# EAGLE design PitchDetector (EAGLE 9.5.1)
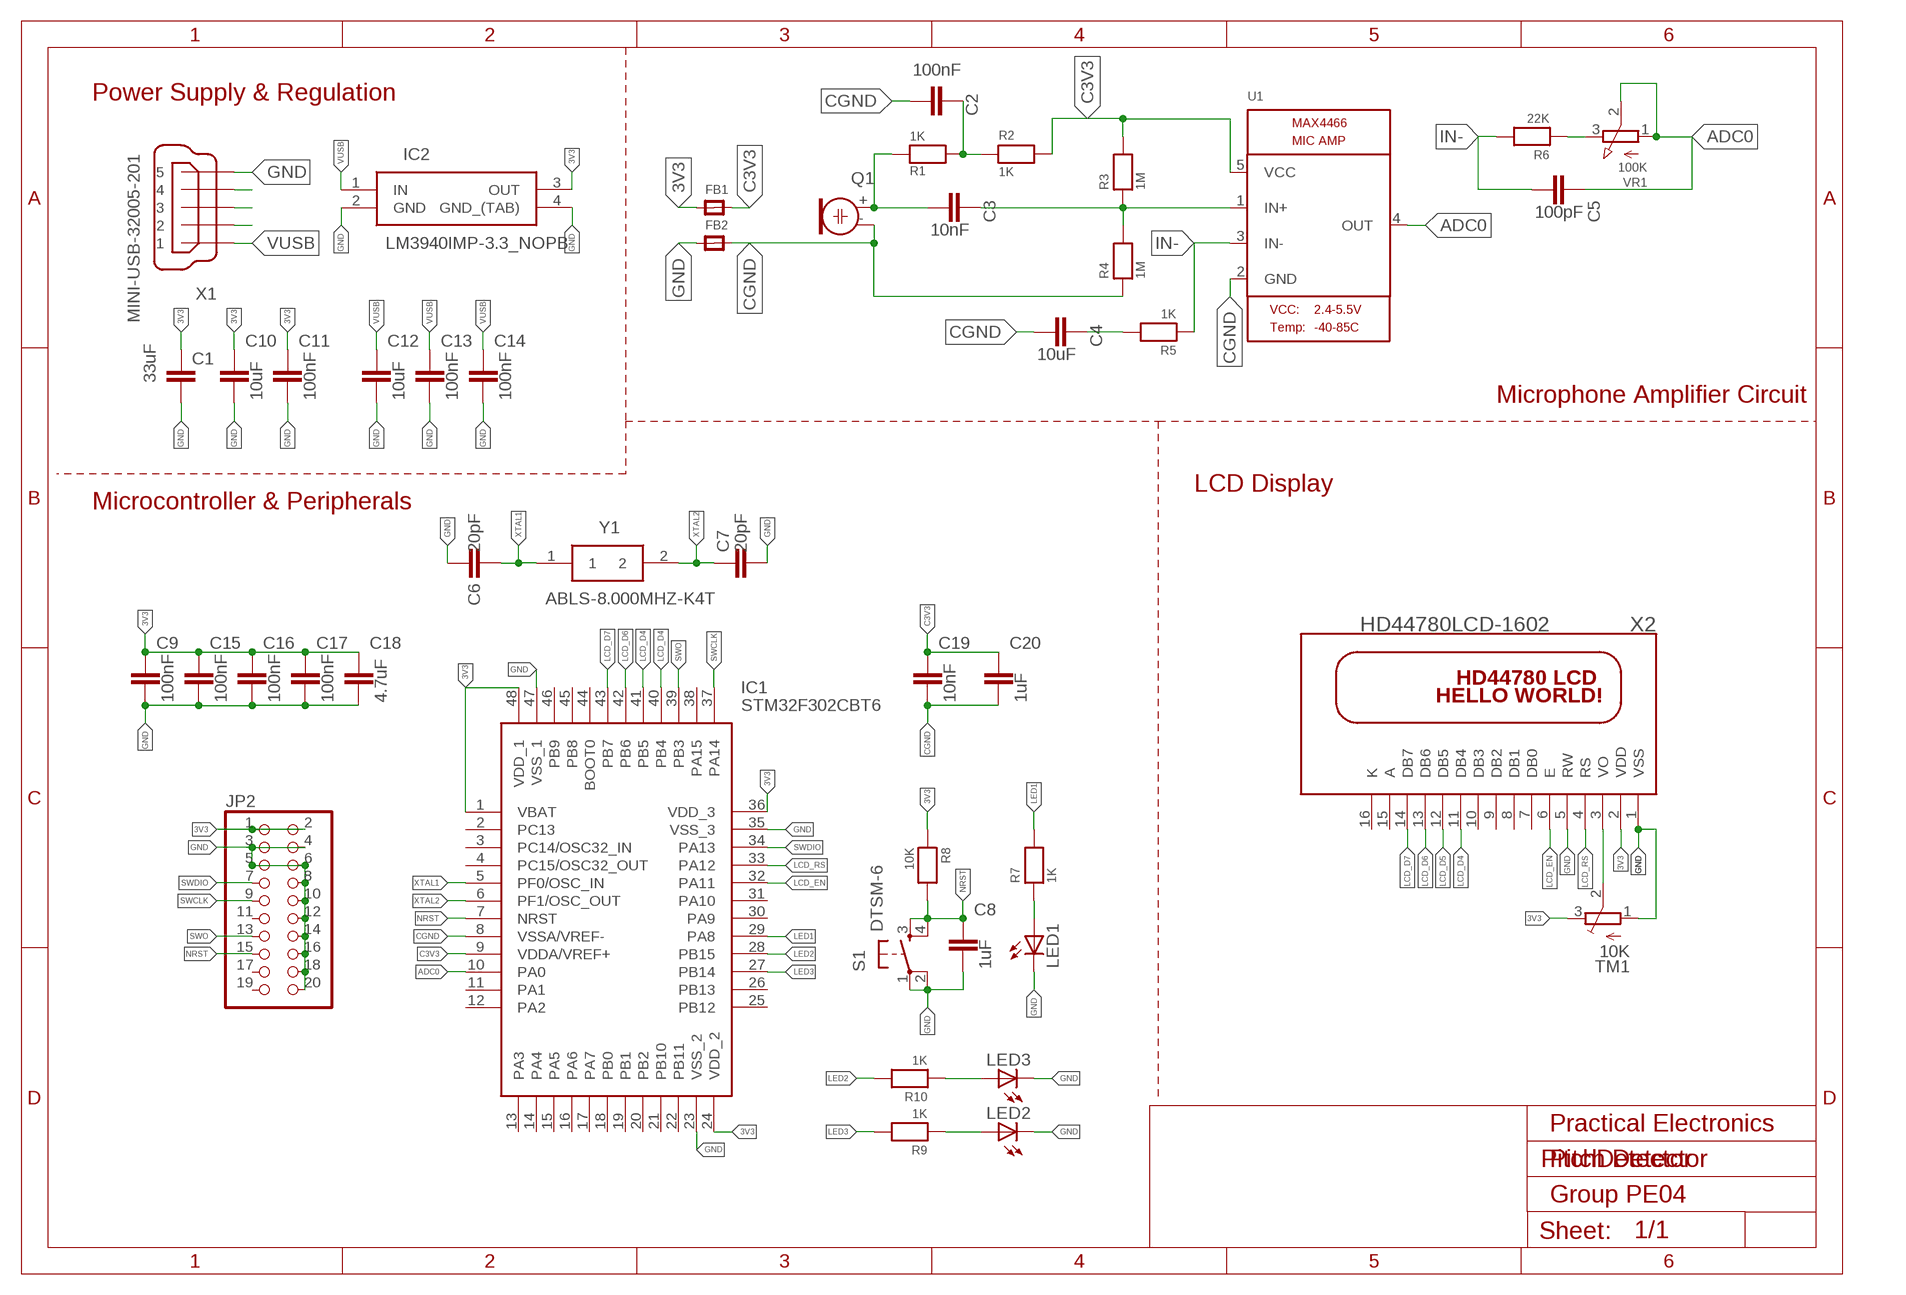
[diagram p0: schematic, sheet 1]

## Parts
C1  33uF  C-EUC1206K  [C1206K]
C2  100nF  C-EUC1206K  [C1206K]
C3  10nF  C-EUC1206K  [C1206K]
C4  10uF  C-EUC1206K  [C1206K]
C5  100pF  C-EUC1206K  [C1206K]
C6  20pF  C-EUC0805K  [C0805K]
C7  20pF  C-EUC0805K  [C0805K]
C8  1uF  C-EUC1206K  [C1206K]
C9  100nF  C-EUC1206K  [C1206K]
C10  10uF  C-EUC1206K  [C1206K]
C11  100nF  C-EUC1206K  [C1206K]
C12  10uF  C-EUC1206K  [C1206K]
C13  100nF  C-EUC1206K  [C1206K]
C14  100nF  C-EUC1206K  [C1206K]
C15  100nF  C-EUC1206K  [C1206K]
C16  100nF  C-EUC1206K  [C1206K]
C17  100nF  C-EUC1206K  [C1206K]
C18  4.7uF  C-EUC1206K  [C1206K]
C19  10nF  C-EUC1206K  [C1206K]
C20  1uF  C-EUC1206K  [C1206K]
FB1  MICROBUILDER_FERRITE_0805  [MICROBUILDER__0805]
FB2  MICROBUILDER_FERRITE_0805  [MICROBUILDER__0805]
IC1  STM32F302CBT6  [QFP50P900X900X160-48N]
IC2  LM3940IMP-3.3_NOPB  [SOT230P700X180-4N]
JP2  PINHD-2X10  [2X10]
LED1  LEDCHIPLED_1206  [CHIPLED_1206]
LED2  LEDCHIPLED_1206  [CHIPLED_1206]
LED3  LEDCHIPLED_1206  [CHIPLED_1206]
Q1  MICROBUILDER_ELECTRET  [MICROBUILDER_ELECTRET_9.7]
R1  1K  MICROBUILDER_RESISTOR1206  [MICROBUILDER_1206]
R2  1K  MICROBUILDER_RESISTOR1206  [MICROBUILDER_1206]
R3  1M  MICROBUILDER_RESISTOR1206  [MICROBUILDER_1206]
R4  1M  MICROBUILDER_RESISTOR1206  [MICROBUILDER_1206]
R5  1K  MICROBUILDER_RESISTOR1206  [MICROBUILDER_1206]
R6  22K  MICROBUILDER_RESISTOR1206  [MICROBUILDER_1206]
R7  1K  MICROBUILDER_RESISTOR1206  [MICROBUILDER_1206]
R8  10K  MICROBUILDER_RESISTOR1206  [MICROBUILDER_1206]
R9  1K  MICROBUILDER_RESISTOR1206  [MICROBUILDER_1206]
R10  1K  MICROBUILDER_RESISTOR1206  [MICROBUILDER_1206]
S1  DTSM-6  [DTSM-6]
TM1  10K  TRIMPOTTC33X  [TC33X]
U1  MICROBUILDER_MAX4466""  [MICROBUILDER_SC70-5]
VR1  100K  MICROBUILDER_TRIMPOTTC33X-2  [MICROBUILDER_TRIMPOT_BOURNS_TC33X-2]
X1  MINI-USB-32005-201  [32005-201]
X2  HD44780LCD-1602  [LCD1602]
Y1  ABLS-8.000MHZ-K4T  [ABLS-12.000MHZ-B2]

## Nets
3V3: C1.1 C9.1 C10.1 C11.1 C15.1 C16.1 C17.1 C18.1 FB1.1 IC1.1(VBAT) IC1.24(VDD_2) IC1.36(VDD_3) IC1.48(VDD_1) IC2.3(OUT) JP2.1 JP2.2 R8.1 TM1.3(E) X2.2(VDD)
ADC0: C5.1 IC1.10(PA0) U1.4(OUT) VR1.1(A) VR1.2(S)
C3V3: C19.1 C20.1 FB1.2 IC1.9(VDDA/VREF+) R2.2 R3.2 U1.5(VCC)
CGND: C2.2 C4.2 C19.2 C20.2 FB2.2 IC1.8(VSSA/VREF-) Q1.- R4.1 U1.2(GND)
GND: C1.2 C6.1 C7.2 C8.2 C9.2 C10.2 C11.2 C12.2 C13.2 C14.2 C15.2 C16.2 C17.2 C18.2 FB2.1 IC1.23(VSS_2) IC1.35(VSS_3) IC1.47(VSS_1) IC2.2(GND) IC2.4(GND_(TAB)) JP2.3 JP2.4 JP2.5 JP2.6 JP2.8 JP2.10 JP2.12 JP2.14 JP2.16 JP2.18 JP2.20 LED1.C LED2.C LED3.C S1.1 S1.2 TM1.1(A) X1.5 X2.1(VSS) X2.5(RW)
IN-: C5.2 R5.1 R6.2 U1.3(IN-)
LCD_D4: IC1.40(PB4) IC1.41(PB5) X2.11(DB4)
LCD_D5: X2.12(DB5)
LCD_D6: IC1.42(PB6) X2.13(DB6)
LCD_D7: IC1.43(PB7) X2.14(DB7)
LCD_EN: IC1.32(PA11) X2.6(E)
LCD_RS: IC1.33(PA12) X2.4(RS)
LED1: IC1.29(PA8) R7.2
LED2: IC1.28(PB15) R10.2
LED3: IC1.27(PB14) R9.2
N$1: LED1.A R7.1
N$2: X1.4
N$3: X1.3
N$4: X1.2
N$5: C3.2 Q1.+ R1.1
N$6: C2.1 R1.2 R2.1
N$7: C3.1 R3.1 R4.2 U1.1(IN+)
N$8: R6.1 VR1.3(E)
N$9: C4.1 R5.2
N$10: TM1.2(S) X2.3(VO)
N$11: LED3.A R10.1
N$12: LED2.A R9.1
NRST: C8.1 IC1.7(NRST) JP2.15 R8.2 S1.3 S1.4
SWCLK: IC1.37(PA14) JP2.9
SWDIO: IC1.34(PA13) JP2.7
SWO: IC1.39(PB3) JP2.13
VUSB: C12.1 C13.1 C14.1 IC2.1(IN) X1.1
XTAL1: C6.2 IC1.5(PF0/OSC_IN) Y1.1
XTAL2: C7.1 IC1.6(PF1/OSC_OUT) Y1.2
Unconnected: IC1.2(PC13) IC1.3(PC14/OSC32_IN) IC1.4(PC15/OSC32_OUT) IC1.11(PA1) IC1.12(PA2) IC1.13(PA3) IC1.14(PA4) IC1.15(PA5) IC1.16(PA6) IC1.17(PA7) IC1.18(PB0) IC1.19(PB1) IC1.20(PB2) IC1.21(PB10) IC1.22(PB11) IC1.25(PB12) IC1.26(PB13) IC1.30(PA9) IC1.31(PA10) IC1.38(PA15) IC1.44(BOOT0) IC1.45(PB8) IC1.46(PB9) JP2.11 JP2.17 JP2.19 X2.7(DB0) X2.8(DB1) X2.9(DB2) X2.10(DB3) X2.15(A) X2.16(K)

## Notes on the sheet
- Power Supply & Regulation
- Microphone Amplifier Circuit
- LCD Display
- Microcontroller & Peripherals
- Practical Electronics
- Pitch Detector
- Group PE04

## Library data of the parts
C1-C5 C8-C20 = resistor:C-EU: CAPACITOR, European symbol
C6 C7 = rcl:C-EU: CAPACITOR, European symbol; SPICEPREFIX: C
FB1 FB2 = Adafruit MAX4466 Mic Amp:MICROBUILDER_FERRITE: Ferrite Bead 0603 MMZ1608B121C - 120 Ohm @ 100MHz, 600mA, 0.15 Ohm DC Resistance - Digikey: 445-2164-1-ND BK1608HW121-T - 120 Ohm, 600mA Ferrite Chip - Digikey: 587-1876-2-ND 0805 HZ0805B272R-10 - 2.7K Ohm @ 100MHz, 200mA, 0.8 Ohm DC Resistance - Digikey: 240-2504-1-ND (see also Murata BLM21BD272SN1L) MMZ2012Y152B - 1.5K Ohm @ 100MHz, 500mA, 0.4 Ohm DC Resistance - Digikey: 445-1560-1-ND - Mainly for high frequency (80-400MHz) MMZ2012R102A - 1K Ohm @ 100MHz, 500mA, 0.3 Ohm DC Resistance - Digikey: 445-1555-2-ND - More general purpose (10-200MHz)
IC1 = SamacSys_Parts:STM32F302CBT6: Source: Datasheet <http://www.st.com/web/en/resource/technical/document/datasheet/DM00094064.pdf>; ALLIED_NUMBER: 70520770; ALLIED_PRICE-STOCK: http://www.alliedelec.com/stmicroelectronics-stm32f302cbt6/70520770/; HEIGHT: 1.6mm; MANUFACTURER_NAME: STMicroelectronics; MANUFACTURER_PART_NUMBER: STM32F302CBT6; MOUSER_PART_NUMBER: 511-STM32F302CBT6; MOUSER_PRICE-STOCK: https://www.mouser.com/Search/Refine.aspx?Keyword=511-STM32F302CBT6; RS_PART_NUMBER: 8107641P; RS_PRICE-STOCK: http://uk.rs-online.com/web/p/products/8107641P
IC2 = SamacSys_Parts:LM3940IMP-3.3_NOPB: LM3940IMP-3.3/NOPB, Low Dropout Voltage Regulator, 1A, 3.3 V, 4.5 7.5 Vin, 4-Pin SOT-223 Source: Datasheet <http://www.ti.com/lit/ds/symlink/lm3940.pdf>; DESCRIPTION: LM3940IMP-3.3/NOPB, Low Dropout Voltage Regulator, 1A, 3.3 V, 4.5 7.5 Vin, 4-Pin SOT-223; HEIGHT: 1.8mm; MANUFACTURER_NAME: Texas Instruments; MANUFACTURER_PART_NUMBER: LM3940IMP-3.3/NOPB; MOUSER_PART_NUMBER: 926-LM3940IMP3.3NOPB; MOUSER_PRICE-STOCK: https://www.mouser.com/Search/Refine.aspx?Keyword=926-LM3940IMP3.3NOPB
JP2 = pinhead:PINHD-2X10: PIN HEADER
LED1-LED3 = adafruit:LED: LED OSRAM: - CHIPLED LG R971, LG N971, LY N971, LG Q971, LY Q971, LO R971, LY R971 LH N974, LH R974 LS Q976, LO Q976, LY Q976 LO Q996 - Hyper CHIPLED LW Q18S LB Q993, LB Q99A, LB R99A - SideLED LS A670, LO A670, LY A670, LG A670, LP A670 LB A673, LV A673, LT A673, LW A673 LH A674 LY A675 LS A676, LA A676, LO A676, LY A676, LW A676 LS A679, LY A679, LG A679 - Hyper Micro SIDELED® LS Y876, LA Y876, LO Y876, LY Y876 LT Y87S - SmartLED LW L88C, LW L88S LB L89C, LB L89S, LG L890 LS L89K, LO L89K, LY L89K LS L896, LA L896, LO L896, LY L896 - TOPLED LS T670, LO T670, LY T670, LG T670, LP T670 LSG T670, LSP T670, LSY T670, LOP T670, LYG T670 LG T671, LOG T671, LSG T671 LB T673, LV T673, LT T673, LW T673 LH T674 LS T676, LA T676, LO T676, LY T676, LB T676, LH T676, LSB T676, LW T676 LB T67C, LV T67C, LT T67C, LS T67K, LO T67K, LY T67K, LW E67C LS E67B, LA E67B, LO E67B, LY E67B, LB E67C, LV E67C, LT E67C LW T67C LS T679, LY T679, LG T679 LS T770, LO T770, LY T770, LG T770, LP T770 LB T773, LV T773, LT T773, LW T773 LH T774 LS E675, LA E675, LY E675, LS T675 LS T776, LA T776, LO T776, LY T776, LB T776 LHGB T686 LT T68C, LB T68C - Hyper Mini TOPLED® LB M676 - Mini TOPLED Santana® LG M470 LS M47K, LO M47K, LY M47K Source: http://www.osram.convergy.de/
Q1 = Adafruit MAX4466 Mic Amp:MICROBUILDER_ELECTRET: Electret microphone Thru hole 2.54mm spacing with 9.7mm diameter
R1-R10 = Adafruit MAX4466 Mic Amp:MICROBUILDER_RESISTOR: Resistors 0402 - 0402 Surface Mount Package 22 Ohm 1% 1/16W [Digikey: 311-22.0LRTR-ND] 33 Ohm 5% 1/16W 1.0K 5% 1/16W 1.5K 5% 1/16W 2.0K 1% 1/16W 10.0K 1% 1/16W [Digikey: 311-10.0KLRTR-ND] 10.0K 5% 1/16W [Digikey: RMCF0402JT10K0TR-ND] 12.1K 1% 1/16W [Digikey: 311-22.0LRTR-ND] 100.0K 5% 1/16W 0603 - 0603 Surface Mount Package 0 Ohm 1/10 Watt 1% Resistor 15 Ohm 1/10 Watt 1% Resistor 33 Ohm 1/10 Watt 1% Resistor 49.9 Ohm 1/10 Watt 1% Resistor 100 Ohm 1/10 Watt 1% Resistor 150 Ohm 1/10 Watt 1% Resistor 240 Ohm 1/10 Watt 1% Resistor 390 Ohm 1/10 Watt 1% Resistor 560 Ohm 1/10 Watt 1% Resistor 680 Ohm 1/10 Watt 1% Resistor 750 Ohm 1/10 Watt 1% Resistor 1.0K Ohm 1/10 Watt 1% Resistor 1.5K Ohm 1/10 Watt 1% Resistor 2.0K Ohm 1/10 Watt 1% Resistor 2.2K Ohm 1/10 Watt 1% Resistor 3.3K Ohm 1/10 Watt 1% Resistor 4.7K Ohm 1/10 Watt 1% Resistor 10.0K Ohm 1/10 Watt 1% Resistor 12.0K Ohm 1/10 Watt 1% Resistor 12.1K Ohm 1/10 Watt 1% Resistor 20.0K Ohm 1/10 Watt 1% Resistor 33.0K Ohm 1/10 Watt 1% Resistor 100.0K Ohm 1/10 Watt 1% Resistor 0805 - 0805 Surface Mount Package 0 Ohm 1/8 Watt 1% Resistor 33 Ohm 1/8 Watt 1% Resistor 100 Ohm 1/8 Watt 1% Resistor 150 Ohm 1/8 Watt 1% Resistor 200 Ohm 1/8 Watt 1% Resistor 240 Ohm 1/8 Watt 1% Resistor 330 Ohm 1/8 Watt 1% Resistor 390 Ohm 1/8 Watt 1% Resistor 470 Ohm 1/8 Watt 1% Resistor 1.0K Ohm 1/8 Watt 1% Resistor 1.5K Ohm 1/8 Watt 1% Resistor 2.0K Ohm 1/8 Watt 1% Resistor 4.7K Ohm 1/8 Watt 1% Resistor 5.1K Ohm 1/8 Watt 1% Resistor 5.6K Ohm 1/8 Watt 1% Resistor 10.0K Ohm 1/8 Watt 1% Resistor 22.0K Ohm 1/8 Watt 1% Resistor 33.0K Ohm 1/8 Watt 1% Resistor 100K Ohm 1/8 Watt 1% Resistor 1206 - 1206 Surface Mount Package 2012 - 2010 Surface Mount Package 0.11 Ohm 1/2 Watt 1% Resistor - Digikey: RHM.11UCT-ND
S1 = switch-tact:DTSM-6
TM1 = adafruit:TRIMPOT: SMT trimmer potentiometer part number TC33X http://www.ladyada.net/library/eagle
U1 = Adafruit MAX4466 Mic Amp:MICROBUILDER_MAX4466: MAX4466 - Microphone Pre-Amp
VR1 = Adafruit MAX4466 Mic Amp:MICROBUILDER_TRIMPOT: 3-Pin SMT Trimpots Bourns TC33 (X-2) Series 10K - Digikey: TC33X-2-103E 100K - Digikey: TC33X-104ECT-ND Bourns 3303 (W) Series 3mm 10K Single Turn - Digikey: 3303W-103ETR-ND 3mm 100K Single Turn - Digikey: 3303X-104ETR-ND
X1 = con-cypressindustries:MINI-USB-: MINI USB-B Conector Source: www.cypressindustries.com; OC_FARNELL: unknown; OC_NEWARK: unknown
X2 = adafruit:HD44780LCD: HD44780 LCD Standard character type LCDs, available in sizes from 8x1 to 40x4!
Y1 = SamacSys_Parts:ABLS-8.000MHZ-K4T: ABRACON - ABLS-8.000MHZ-K4T - CRYSTAL, 8MHZ, 18PF, HC-49US Source: Datasheet <https://componentsearchengine.com/Datasheets/1/ABLS-8.000MHZ-K4T.pdf>; DESCRIPTION: ABRACON - ABLS-8.000MHZ-K4T - CRYSTAL, 8MHZ, 18PF, HC-49US; HEIGHT: mm; MANUFACTURER_NAME: ABRACON; MANUFACTURER_PART_NUMBER: ABLS-8.000MHZ-K4T; MOUSER_PART_NUMBER: 815-ABLS-8.0MK4-T; MOUSER_PRICE-STOCK: https://www.mouser.com/Search/Refine.aspx?Keyword=815-ABLS-8.0MK4-T

## Board
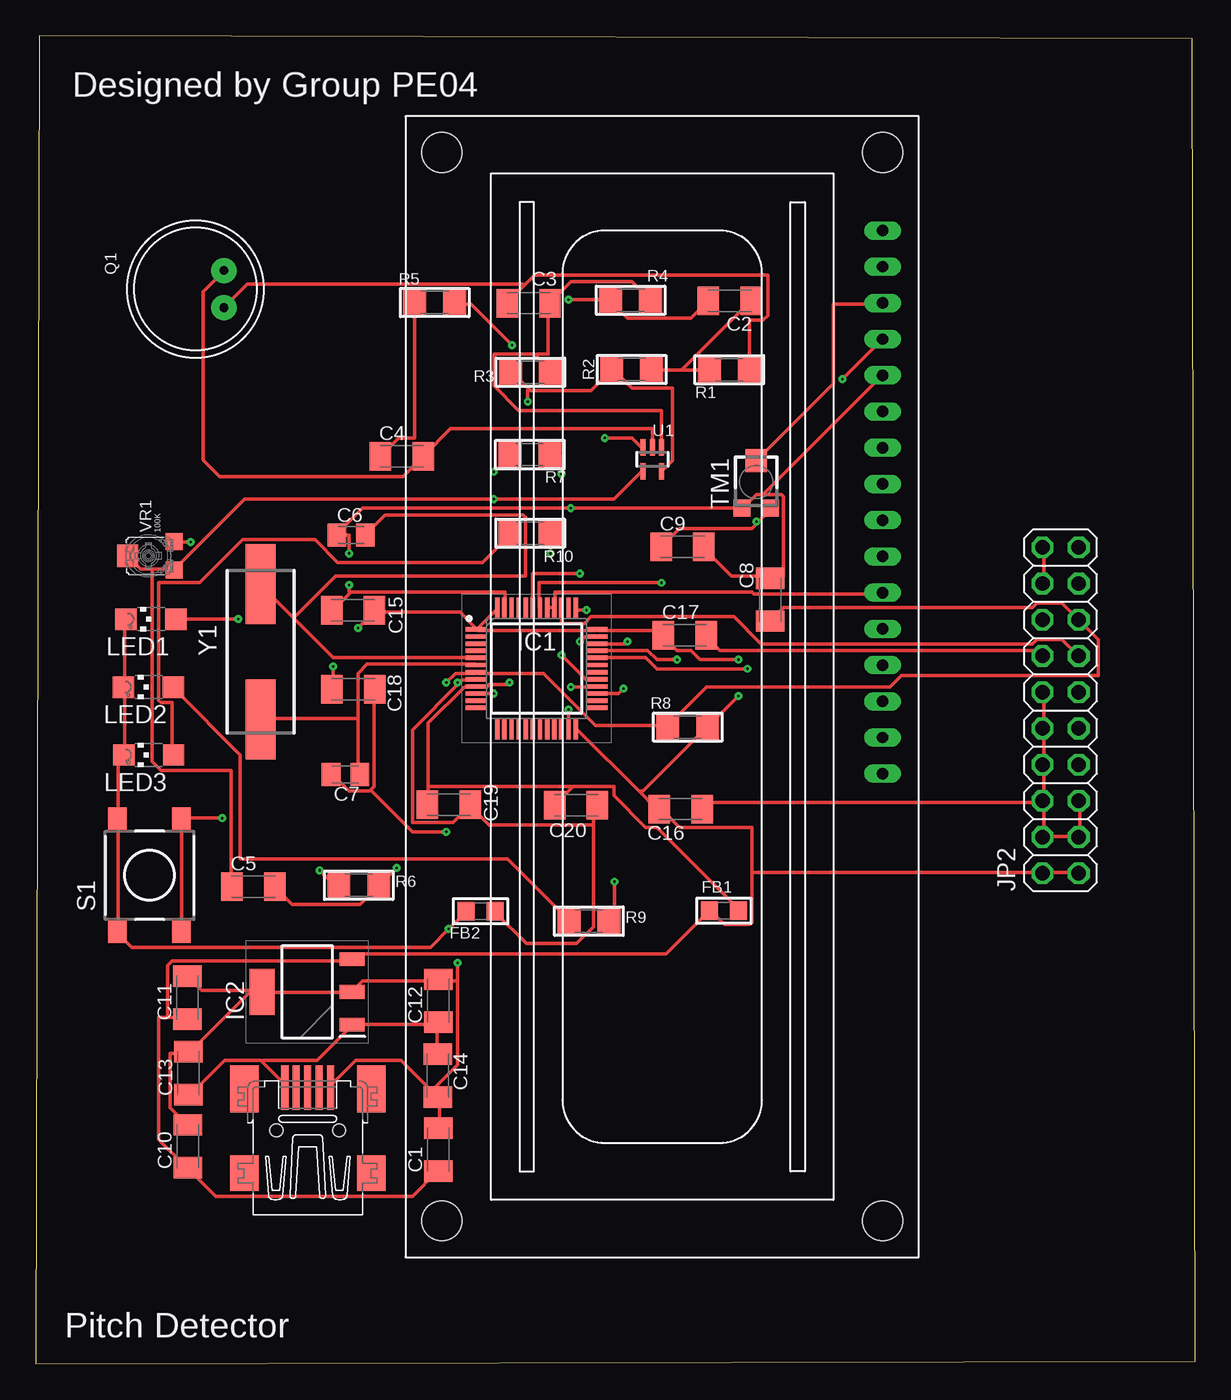
[diagram p1: board, top side]
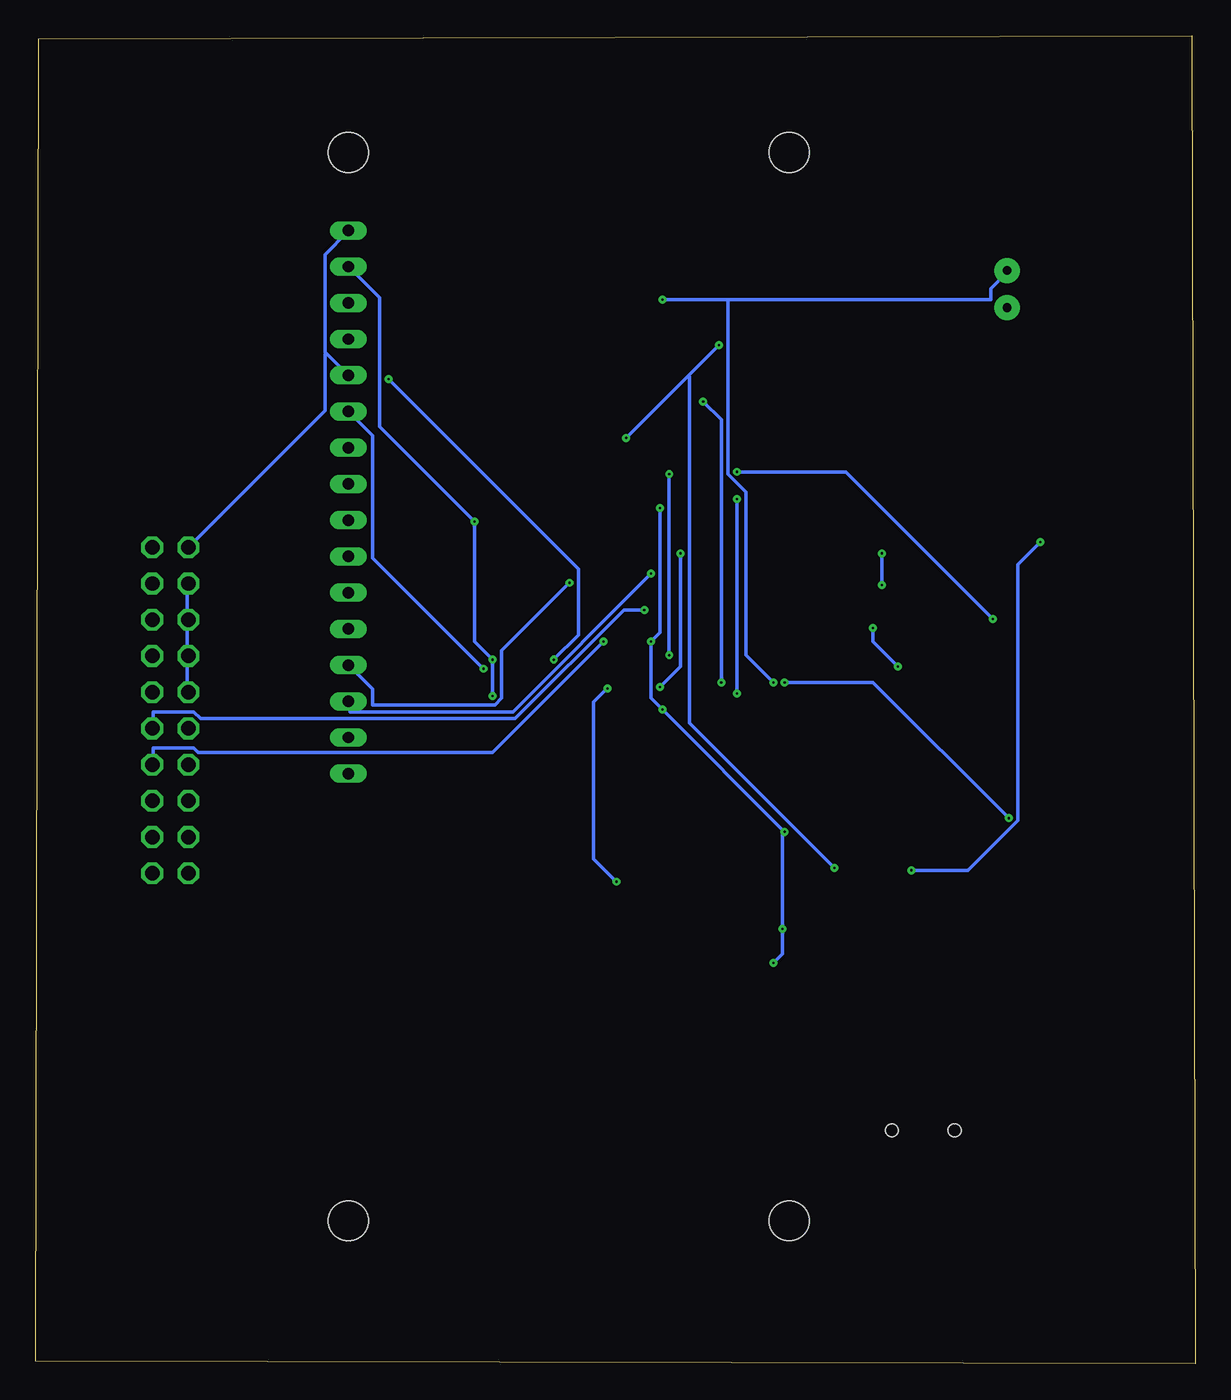
[diagram p2: board, bottom side, seen from below]

Size 81.33 x 93.15 mm. Coordinates in mm from the lower left corner, seen from the top.
Outline: 0,0 81.33,0.19 81.11,92.94 0.25,93.15 0,0
Copper layers (1*16): Top 0.035mm / dielectric 1.5mm / Bottom 0.035mm
Design rules "default *": minimum track width 9mil, minimum drill 0.15mm, track to track 6mil, track to pad 6mil, pad to pad 6mil, via to via 6mil, smd to smd 6mil, copper to edge 40mil, drill to drill 6mil, minimum pad ring 10mil, minimum via ring 8mil, stop-mask expansion 4mil, vias tented up to drill 0mil, thermal gap 10mil

### Footprints (pad centres in the part's own frame; a part is rotated, then mirrored left to right if it is on the bottom)
C1206K = smd 1.5 x 2: 1 -1.5,0; 2 1.5,0
C0805K = smd 1.3 x 1.6: 1 -1,0; 2 1,0
MICROBUILDER__0805 = smd 1.2 x 1.3: 1 -1.016,0; 2 1.016,0
QFP50P900X900X160-48N = smd 1.475 x 0.3: 1 -4.238,2.75; 2 -4.238,2.25; 3 -4.238,1.75; 4 -4.238,1.25; 5 -4.238,0.75; 6 -4.238,0.25; 7 -4.238,-0.25; 8 -4.238,-0.75; 9 -4.238,-1.25; 10 -4.238,-1.75; 11 -4.238,-2.25; 12 -4.238,-2.75; 25 4.238,-2.75; 26 4.238,-2.25; 27 4.238,-1.75; 28 4.238,-1.25; 29 4.238,-0.75; 30 4.238,-0.25; 31 4.238,0.25; 32 4.238,0.75; 33 4.238,1.25; 34 4.238,1.75; 35 4.238,2.25; 36 4.238,2.75 | smd 0.3 x 1.475: 13 -2.75,-4.238; 14 -2.25,-4.238; 15 -1.75,-4.238; 16 -1.25,-4.238; 17 -0.75,-4.238; 18 -0.25,-4.238; 19 0.25,-4.238; 20 0.75,-4.238; 21 1.25,-4.238; 22 1.75,-4.238; 23 2.25,-4.238; 24 2.75,-4.238; 37 2.75,4.238; 38 2.25,4.238; 39 1.75,4.238; 40 1.25,4.238; 41 0.75,4.238; 42 0.25,4.238; 43 -0.25,4.238; 44 -0.75,4.238; 45 -1.25,4.238; 46 -1.75,4.238; 47 -2.25,4.238; 48 -2.75,4.238
SOT230P700X180-4N = smd 1.75 x 0.95: 1 -3.15,2.3; 2 -3.15,0; 3 -3.15,-2.3 | smd 1.75 x 3.2: 4 3.15,0
2X10 = drill 1.016 octagon: 1 -11.43,-1.27; 2 -11.43,1.27; 3 -8.89,-1.27; 4 -8.89,1.27; 5 -6.35,-1.27; 6 -6.35,1.27; 7 -3.81,-1.27; 8 -3.81,1.27; 9 -1.27,-1.27; 10 -1.27,1.27; 11 1.27,-1.27; 12 1.27,1.27; 13 3.81,-1.27; 14 3.81,1.27; 15 6.35,-1.27; 16 6.35,1.27; 17 8.89,-1.27; 18 8.89,1.27; 19 11.43,-1.27; 20 11.43,1.27
CHIPLED_1206 = smd 1.5 x 1.5: A 0,-1.75; C 0,1.75
MICROBUILDER_ELECTRET_9.7 = drill 0.6 pad 1.778: + 1.3,2; - -1.3,2
MICROBUILDER_1206 = smd 1.6 x 1.8: 1 -1.4,0; 2 1.4,0
DTSM-6 = smd 1.55 x 1.3: 1 -3.975,2.25; 2 3.975,2.25; 3 -3.975,-2.25; 4 3.975,-2.25
TC33X = smd 1.2 x 1.2: 1 -1,-1.825; 3 1,-1.825 | smd 1.5 x 1.6: 2 0,1.5
MICROBUILDER_SC70-5 = smd 0.35 x 1.15: 1 -0.65,-0.85; 2 0,-0.85; 3 0.65,-0.85; 4 0.65,0.85; 5 -0.65,0.85
MICROBUILDER_TRIMPOT_BOURNS_TC33X-2 = smd 1.2 x 1.2: 1 -1,-1.8; 3 1,-1.8 | smd 1.6 x 1.5: 2 0,1.45
32005-201 = smd 3.1 x 0.5: 1 3,1.6; 2 3,0.8; 3 3,0; 4 3,-0.8; 5 3,-1.6 | smd 2.5 x 2: M1 -3,-4.45; M2 -3,4.45 | smd 3.3 x 2: M3 2.9,4.45; M4 2.9,-4.45 | hole 0.9: 0,2.2; 0,-2.2
LCD1602 = drill 0.8 long: 1 8,33.46; 2 10.54,33.46; 3 13.08,33.46; 4 15.62,33.46; 5 18.16,33.46; 6 20.7,33.46; 7 23.24,33.46; 8 25.78,33.46; 9 28.32,33.46; 10 30.86,33.46; 11 33.4,33.46; 12 35.94,33.46; 13 38.48,33.46; 14 41.02,33.46; 15 43.56,33.46; 16 46.1,33.46 | hole 2.8: 2.54,2.54; 2.54,33.46; 77.46,33.46; 77.46,2.54
ABLS-12.000MHZ-B2 = smd 5.6 x 2.1: 1 -4.75,0; 2 4.75,0

### Placement (x,y rotation side)
C1  28.24,15.02 90 top
C2  48.67,74.54 180 top
C3  34.57,74.39 180 top
C4  25.69,63.65 0 top
C5  15.27,33.47 0 top
C6  22.12,58.13 0 top
C7  21.72,41.34 180 top
C8  51.51,53.6 90 top
C9  45.37,57.3 0 top
C10  10.67,15.26 90 top
C11  10.66,25.69 90 top
C12  28.24,25.47 90 top
C13  10.72,20.39 90 top
C14  28.2,20.22 270 top
C15  22.26,52.86 180 top
C16  45.24,38.91 0 top
C17  45.53,51.1 0 top
C18  22.28,47.32 0 top
C19  28.98,39.22 0 top
C20  37.9,39.17 0 top
FB1  48.28,31.78 0 top
FB2  31.2,31.74 0 top
IC1  35.12,48.76 0 top
IC2  19.05,26.09 180 top
JP2  71.89,45.84 90 top
LED1  8.09,52.23 90 top
LED2  7.91,47.47 90 top
LED3  7.93,42.7 90 top
Q1  11.2,75.37 270 top
R1  48.65,69.72 180 top
R2  41.8,69.74 180 top
R3  34.71,69.55 180 top
R4  41.73,74.6 0 top
R5  27.99,74.44 180 top
R6  22.67,33.56 0 top
R7  34.67,63.77 0 top
R8  45.74,44.66 180 top
R9  38.81,31.05 0 top
R10  34.68,58.26 0 top
S1  7.99,34.27 90 top
TM1  50.53,61.84 0 top
U1  43.26,63.43 180 top
VR1  7.91,56.68 90 top
X1  19.08,16.37 90 top
X2  25.95,87.49 270 top
Y1  15.77,49.95 270 top

### Tracks (layer width: path | path; a pad name or v marks a point on that pad's centre or on a via)
3V3  (via drill 0.15)
  Top 0.229: IC1.1 31.02,51.61 32.29,52.88 IC1.48 | v20.86,48.91 20.86,47.32 C18.1 | v22.61,51.61 23.72,52.72 C15.1 23.88,52.72 29.75,52.72 30.86,51.61 IC1.1 | IC1.1 31.02,51.45 39.28,51.45 IC1.36 39.44,51.45 43.56,51.45 43.88,51.13 C17.1 44.04,50.97 44.99,50.02 45.95,50.02 46.58,49.38 v49.28,49.38 | 50.63,58.99 50.23,58.59 45.15,58.59 43.88,57.32 C9.1 | 50.63,58.99 51.5,59.86 TM1.3 | v50.55,59.07 50.63,58.99 | 9.27,24.3 9.27,27.95 9.59,28.27 22.13,28.27 IC2.3 22.29,28.43 22.61,28.75 44.2,28.75 47.22,31.76 FB1.1 47.37,31.76 48.33,30.81 50.07,30.81 50.23,30.97 50.23,34.46 | 9.27,24.3 10.54,24.3 C11.1 | 9.27,24.3 8.64,24.3 8.64,15.73 10.54,13.82 C10.1 10.7,13.66 12.61,11.76 26.42,11.76 28.17,13.51 C1.1 | JP2.1 73.09,34.46 70.71,34.46 JP2.2 70.55,34.46 50.23,34.46 | 50.23,34.46 50.23,37.64 45.15,37.64 43.88,38.91 C16.1 43.72,39.06 43.41,39.06 42.37,40.1 | 42.37,40.1 38.01,44.46 IC1.24 | 42.37,40.1 42.45,40.18 42.61,40.18 47.06,44.62 R8.1 47.22,44.78 v49.28,46.84
  Bottom 0.229: v20.86,48.91 22.61,50.65 v22.61,51.61 | X2.2 59.28,76.85 57.22,74.78 57.22,65.73 v50.55,59.07 50.55,50.65 v49.28,49.38 v49.28,46.84
ADC0  (via drill 0.15)
  Top 0.229: U1.4 42.45,62.56 40.55,60.65 v32.13,60.65 14.67,60.65 9.75,55.73 VR1.1 9.59,55.73 8.16,55.73 | v32.13,47 31.02,47 IC1.10 | 8.16,55.73 7.37,55.73 6.58,56.53 VR1.2 | 8.16,55.73 8.16,42.24 8.8,41.6 13.72,41.6 13.72,33.51 C5.1
  Bottom 0.229: v32.13,60.65 v32.13,47
C3V3  (via drill 0.15)
  Top 0.229: U1.5 44.04,62.72 44.68,63.35 44.68,68.43 41.82,68.43 40.55,69.7 R2.2 40.39,69.7 38.96,68.27 34.67,68.27 34.6,68.35 | 34.6,68.35 33.4,69.54 R3.2 | 27.53,40.49 27.53,39.22 C19.1 | 27.53,40.49 27.53,44.94 30.07,47.48 30.86,47.48 IC1.9 31.02,47.48 31.66,47.48 31.82,47.64 33.09,47.64 v33.25,47.8 | 37.61,40.41 36.42,39.22 C20.1 | 37.61,40.41 37.69,40.49 40.55,40.49 40.55,39.86 42.77,37.64 43.56,37.64 49.28,31.92 FB1.2 | 27.53,40.49 37.53,40.49 37.61,40.41 | v34.52,67.48 34.52,68.27 34.6,68.35
  Bottom 0.229: v34.52,67.48 33.25,66.21 v33.25,47.8
CGND  (via drill 0.15)
  Top 0.229: 29.67,47.72 26.42,44.46 26.42,37.95 29.28,37.95 30.39,39.06 C19.2 30.55,39.06 31.82,37.79 39.12,37.79 | 29.67,47.72 29.91,47.95 30.86,47.95 IC1.8 | 39.12,37.79 39.12,39.06 39.28,39.06 C20.2 | 39.12,37.79 39.12,30.65 37.95,29.48 34.41,29.48 32.29,31.6 FB2.2 | C2.2 47.06,74.47 45.95,73.35 41.5,73.35 40.39,74.47 R4.1 40.23,74.62 v37.37,74.62 | U1.2 43.25,64.31 43.25,65.58 29.12,65.58 27.21,63.67 C4.2 27.05,63.51 25.78,62.24 12.89,62.24 11.76,63.38 11.76,75.2 13.08,76.53 Q1.- | v29.59,47.8 29.67,47.72
  Bottom 0.229: 32.77,74.62 14.35,74.62 14.35,75.42 13.24,76.53 Q1.- | 32.77,74.62 v37.37,74.62 | v29.59,47.8 31.5,49.7 31.5,61.13 32.77,62.4 32.77,74.62
GND  (via drill 0.15)
  Top 0.229: JP2.20 70.71,57.16 70.71,54.78 JP2.18 | C17.2 47.06,50.97 48.01,50.02 70.23,50.02 70.55,49.7 JP2.14 | JP2.5 73.25,39.38 73.25,37 JP2.3 73.09,37 70.71,37 | C16.2 46.9,39.06 47.22,39.38 70.55,39.38 JP2.6 | 70.71,37 70.71,39.38 JP2.6 | 70.71,37 JP2.4 | JP2.6 70.71,39.54 70.71,41.92 JP2.8 70.71,42.08 70.71,44.46 JP2.10 70.71,44.62 70.71,47 JP2.12 | LED1.C 6.26,52.08 6.26,47.48 LED2.C 6.26,47.32 6.26,42.72 LED3.C 6.1,42.56 5.78,42.56 5.78,38.27 S1.2 5.78,38.11 5.78,30.33 S1.1 5.78,30.17 6.73,29.22 27.69,29.22 v28.96,30.49 30.07,31.6 FB2.1 | C1.2 28.32,16.68 28.32,18.59 C14.2 | C14.2 28.17,18.74 25.63,21.28 22.45,21.28 20.55,19.38 X1.5 | C10.2 10.54,16.84 9.43,17.95 9.43,21.76 10.7,21.76 C13.2 10.86,21.92 15.15,26.21 | 15.15,26.21 15.78,26.21 IC2.4 | 15.15,26.21 11.66,26.21 10.7,27.16 C11.2 | 15.15,26.21 IC2.4 | IC2.4 15.94,26.05 22.13,26.05 IC2.2 22.29,26.21 22.93,26.84 28.17,26.84 C12.2 28.32,26.84 29.59,26.84 | 29.59,26.84 29.59,20.97 27.85,19.22 C14.2 | 22.05,54.07 20.86,52.88 C15.2 | 22.05,54.07 22.13,54.15 32.93,54.15 32.93,53.03 IC1.47 | 23.48,40.26 23.72,40.49 23.72,47.16 C18.2 | 23.48,40.26 23.4,40.18 21.97,40.18 20.86,41.29 C7.2 | v37.37,45.89 37.37,44.62 IC1.23 | v38.17,50.65 38.48,50.97 39.28,50.97 IC1.35 | 51.03,60.97 52.3,60.97 52.45,60.81 52.45,55.26 51.66,55.26 C8.2 51.5,55.26 48.8,55.26 46.9,57.16 C9.2 | 51.03,60.97 50.55,60.97 49.6,60.02 TM1.1 49.44,60.02 v37.53,60.02 22.93,60.02 21.18,58.27 C6.1 21.18,58.11 21.97,58.11 v21.97,56.84 | 51.03,60.97 59.28,69.23 X2.5 | 23.48,40.26 26.42,37.32 v28.8,37.32 | v21.97,54.62 21.97,54.15 22.05,54.07 | v29.59,28.11 29.59,26.84
  Bottom 0.229: JP2.18 70.71,54.62 70.71,52.24 JP2.16 70.71,52.08 70.71,49.7 JP2.14 70.71,49.54 70.71,47.16 JP2.12 | 60.95,70.89 59.44,69.39 X2.5 | 60.95,70.89 61.03,70.97 61.03,77.8 59.44,79.39 X2.1 | v37.53,60.02 37.53,51.29 v38.17,50.65 38.17,46.68 v37.37,45.89 v28.8,37.32 28.96,37.32 v28.96,30.49 28.96,28.75 v29.59,28.11 | v21.97,56.84 v21.97,54.62 | JP2.20 70.55,57.32 61.03,66.85 61.03,70.81 60.95,70.89
IN-  (via drill 0.15)
  Top 0.229: C5.2 16.89,33.35 18.01,32.24 22.77,32.24 24.04,33.51 R6.2 24.2,33.67 v25.31,34.78 | v39.91,64.94 41.82,64.94 42.45,64.31 U1.3 | v33.4,71.45 30.55,74.31 29.44,74.31 R5.1
  Bottom 0.229: v33.4,71.45 35.55,69.31 | 35.55,69.31 v39.91,64.94 | v25.31,34.78 35.47,44.94 35.47,69.23 35.55,69.31
LCD_D4
  Top 0.229: IC1.41 35.94,53.03 36.26,53.03 IC1.40 36.42,53.03 36.42,54.15 50.23,54.15 50.39,53.99 59.28,53.99 X2.11
LCD_D6  (via drill 0.15)
  Top 0.229: v43.88,54.78 35.31,54.78 35.31,53.03 IC1.42
  Bottom 0.229: v43.88,54.78 48.64,50.02 48.64,46.68 49.12,46.21 57.69,46.21 57.69,47.32 59.28,48.91 X2.13
LCD_D7  (via drill 0.15)
  Top 0.229: v38.17,55.42 34.83,55.42 34.83,53.03 IC1.43
  Bottom 0.229: v38.17,55.42 47.85,45.73 59.28,45.73 59.28,46.37 X2.14
LCD_EN  (via drill 0.15)
  Top 0.229: v49.91,48.75 43.56,48.75 42.77,49.54 39.44,49.54 IC1.32
  Bottom 0.229: v49.91,48.75 57.69,56.53 57.69,65.1 59.28,66.69 X2.6
LCD_RS  (via drill 0.15)
  Top 0.229: v44.99,49.38 43.56,49.38 42.93,50.02 39.44,50.02 IC1.33 | v56.58,69.07 59.28,71.77 X2.4
  Bottom 0.229: v44.99,49.38 43.25,51.13 43.25,55.73 v56.58,69.07
LED1  (via drill 0.15)
  Top 0.229: v36.9,49.7 38.64,47.95 39.28,47.95 IC1.29 | v36.9,62.4 36.9,63.67 36.1,63.67 R7.2
  Bottom 0.229: v36.9,62.4 v36.9,49.7
LED2  (via drill 0.15)
  Top 0.229: v37.53,47.48 39.28,47.48 IC1.28 | v36.1,56.84 36.1,58.11 R10.2
  Bottom 0.229: v37.53,47.48 36.1,48.91 v36.1,56.84
LED3  (via drill 0.15)
  Top 0.229: 40.23,31.13 40.55,31.13 | IC1.27 39.44,47 40.88,47 v41.24,47.36 | 40.23,31.13 R9.2 | v40.59,33.81 40.59,31.49 40.23,31.13
  Bottom 0.229: v40.59,33.81 42.2,35.42 42.2,46.4 v41.24,47.36
N$1  (via drill 0.15)
  Top 0.229: v14.2,52.24 9.91,52.24 LED1.A | v32.13,62.56 33.25,63.67 R7.1
  Bottom 0.229: v14.2,52.24 24.51,62.56 v32.13,62.56
N$5
  Top 0.229: 34.28,75.66 33.09,74.47 C3.2 | 34.28,75.66 34.99,76.37 51.34,76.37 51.34,73.51 51.03,73.2 50.07,73.2 50.07,69.86 R1.1 | Q1.+ 13.24,74.15 14.83,75.74 34.2,75.74 34.28,75.66
N$6
  Top 0.229: 45.31,69.7 43.25,69.7 R2.1 | 45.31,69.7 47.22,69.7 R1.2 | 45.31,69.7 50.07,74.47 C2.1
N$7
  Top 0.229: R4.2 43.09,74.62 41.82,75.89 37.53,75.89 36.1,74.47 C3.1 35.94,74.31 35.94,70.81 35.15,70.81 35.07,70.74 | 35.07,70.74 36.1,69.7 R3.1 | 35.07,70.74 34.99,70.81 32.13,70.81 32.13,68.59 33.88,66.85 43.88,66.85 43.88,64.31 U1.1
N$8  (via drill 0.15)
  Top 0.229: v10.86,57.64 9.75,57.64 VR1.3 | v19.91,34.62 20.86,33.67 21.18,33.67 R6.1
  Bottom 0.229: v10.86,57.64 12.45,56.05 12.45,38.11 15.94,34.62 v19.91,34.62
N$9
  Top 0.229: R5.2 26.58,74.31 26.58,64.94 25.47,64.94 24.2,63.67 C4.1
N$10
  Top 0.229: TM1.2 50.55,63.35 55.95,68.75 55.95,74.31 59.28,74.31 X2.3
N$11
  Top 0.229: LED3.A 9.59,42.72 9.59,46.37 8.8,46.37 8.64,46.53 8.64,54.78 11.5,54.78 14.51,57.8 19.59,57.8 21.18,56.21 31.34,56.21 33.25,58.11 R10.1
N$12
  Top 0.229: LED2.A 9.75,47.32 14.35,42.72 14.35,35.41 33.09,35.41 37.37,31.13 R9.1
NRST  (via drill 0.15)
  Top 0.229: C8.1 51.66,52.24 52.45,53.03 69.92,53.03 70.23,53.35 71.98,53.35 73.09,52.24 JP2.15 73.25,52.08 74.52,50.81 74.52,48.27 60.71,48.27 59.92,47.48 47.06,47.48 44.36,44.78 R8.2 44.2,44.78 39.28,44.78 35.63,48.43 31.02,48.43 IC1.7 30.86,48.43 29.44,48.43 v28.8,47.8 | S1.3 10.23,30.33 10.23,38.11 S1.4 10.39,38.27 v13.08,38.27
  Bottom 0.229: v13.08,38.27 22.61,47.8 v28.8,47.8
SWCLK  (via drill 0.15)
  Top 0.229: v38.64,52.88 38.01,52.88 IC1.37
  Bottom 0.229: v38.64,52.88 40.07,52.88 47.69,45.26 69.76,45.26 70.23,45.73 73.09,45.73 73.09,44.62 JP2.9
SWDIO  (via drill 0.15)
  Top 0.229: v41.5,50.65 41.34,50.49 39.44,50.49 IC1.34
  Bottom 0.229: v41.5,50.65 49.28,42.87 69.92,42.87 70.23,43.19 73.09,43.19 73.09,42.08 JP2.7
SWO
  Top 0.229: IC1.39 36.9,52.88 36.9,51.92 38.48,51.92 38.96,52.4 48.96,52.4 50.87,50.49 69.92,50.49 70.23,50.81 71.98,50.81 73.09,49.7 JP2.13
VUSB
  Top 0.229: 28.17,23.82 22.29,23.82 IC2.1 22.13,23.67 19.75,21.28 15.94,21.28 15.86,21.21 | 28.17,23.82 28.17,21.76 C14.1 | 28.17,23.82 C12.1 | 15.86,21.21 17.37,19.7 17.37,19.38 X1.1 | 15.86,21.21 15.78,21.28 13.24,21.28 10.86,18.9 C13.1
XTAL1
  Top 0.229: 18.09,52.32 15.78,54.62 Y1.1 | 18.09,52.32 20.86,49.54 30.86,49.54 IC1.5 | 18.09,52.32 21.02,55.26 34.36,55.26 34.36,59.38 34.2,59.54 24.51,59.54 23.24,58.27 C6.2
XTAL2
  Top 0.229: 22.61,45.26 22.61,41.45 C7.1 | 22.61,45.26 22.61,48.43 23.24,49.07 30.86,49.07 IC1.6 | 22.61,45.26 15.78,45.26 Y1.2

### Text on the board
tPlace: Designed by Group PE04 | Pitch Detector